# EAGLE schematic HV Wiring (EAGLE 8.6.2)
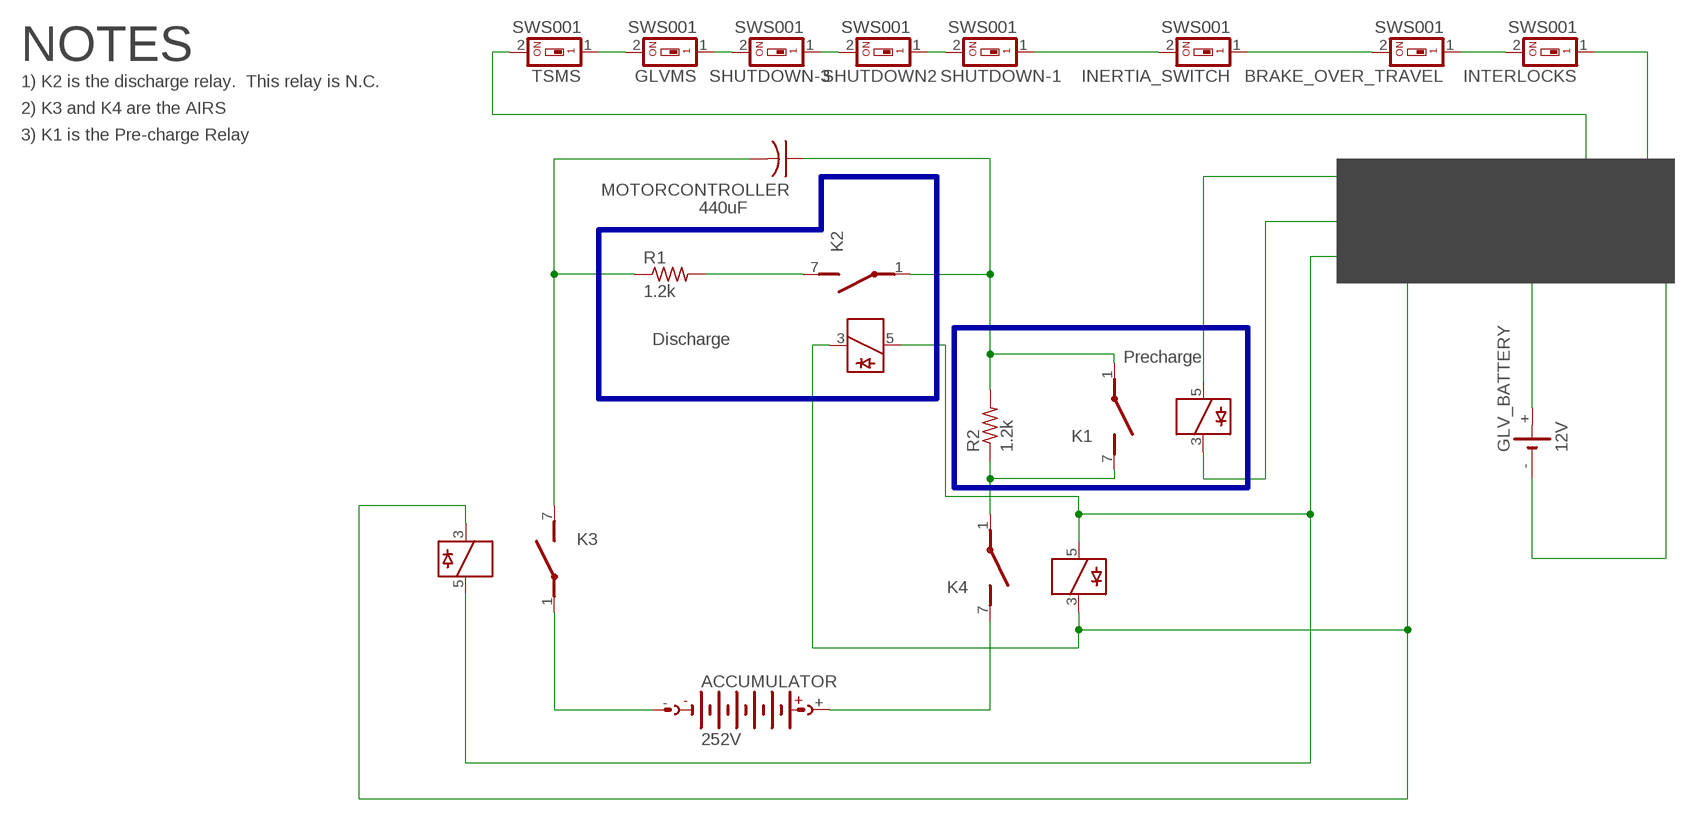
[diagram p0: schematic, sheet 1]

## Parts
ACCUMULATOR  252V  AB9V  [AB9V]
BRAKE_OVER_TRAVEL  SWS001  [SMS-001]
GLV_BATTERY  12V  CH291-1220LF  [CH291-1220LF]
GLVMS  SWS001  [SMS-001]
INERTIA_SWITCH  SWS001  [SMS-001]
INTERLOCKS  SWS001  [SMS-001]
K1  35701331  [REED]
K2  35701331  [REED]
K3  35701331  [REED]
K4  35701331  [REED]
MOTORCONTROLLER  440uF  C-US025-024X044  [C025-024X044]
R1  1.2k  R-US_0204/2V  [0204V]
R2  1.2k  R-US_0204/2V  [0204V]
SHUTDOWN2  SWS001  [SMS-001]
SHUTDOWN-1  SWS001  [SMS-001]
SHUTDOWN-3  SWS001  [SMS-001]
TSMS  SWS001  [SMS-001]

## Nets
N$1: K3.7(2:S) MOTORCONTROLLER.2 R1.1
N$2: ACCUMULATOR.- K3.1(2:P)
N$3: ACCUMULATOR.+ K4.7(2:S)
N$4: K1.7(2:S) K4.1(2:P) R2.1
N$5: K1.1(2:P) K2.1(2:P) MOTORCONTROLLER.1 R2.2
N$6: GLV_BATTERY.+
N$7: GLV_BATTERY.-
N$8: K2.7(2:S) R1.2
N$9: INTERLOCKS.1
N$10: TSMS.2
N$11: BRAKE_OVER_TRAVEL.1 INTERLOCKS.2
N$12: BRAKE_OVER_TRAVEL.2 INERTIA_SWITCH.1
N$13: INERTIA_SWITCH.2 SHUTDOWN-1.1
N$14: SHUTDOWN2.1 SHUTDOWN-1.2
N$15: SHUTDOWN2.2 SHUTDOWN-3.1
N$16: GLVMS.1 SHUTDOWN-3.2
N$17: GLVMS.2 TSMS.1
N$18: K1.5
N$19: K1.3
N$20: K2.5 K3.5 K4.5
N$21: K2.3 K3.3 K4.3

## Buses
B$1
B$2

## Notes on the sheet
- NOTES
- 1) K2 is the discharge relay.  This relay is N.C.
- 2) K3 and K4 are the AIRS
- 3) K1 is the Pre-charge Relay
- To_Precharge | From TSMS
- From Precharge
- To Buttons
- SHUTDOWN CIRCUIT
- To AIRS
- From AIRS | +12V | GND
- Discharge
- Precharge

## Library data of the parts
ACCUMULATOR = battery:AB9V: 9-V BATTERY CLIP
BRAKE_OVER_TRAVEL GLVMS INERTIA_SWITCH INTERLOCKS SHUTDOWN2 SHUTDOWN-1 SHUTDOWN-3 TSMS = smd-special:SWS001: SMD Dip Switch 1 pol.
GLV_BATTERY = battery:CH291-1220LF: Battery Holder, SMT, 12mm multicomp PART NO. CH291-1220LF Source: Data sheet <http://www.farnell.com/datasheets/1505860.pdf>
K1-K4 = relay:35701331: RELAY reed, 1 x norm. open with polarity; OC_FARNELL: unknown; OC_NEWARK: unknown
MOTORCONTROLLER = rcl:C-US: CAPACITOR, American symbol; SPICEPREFIX: C
R1 R2 = rcl:R-US_: RESISTOR, American symbol; SPICEPREFIX: R